# Altium schematic sheet passive_balancing.SchDoc: foxBMS BMS-Slave 12-Cell
size A3; DocumentNumber: 5; SheetNumber: 5; SheetTotal: 15; AUTHOR: Fraunhofer IISB foxBMS Team; SheetDescription: Passive Cell Balancing
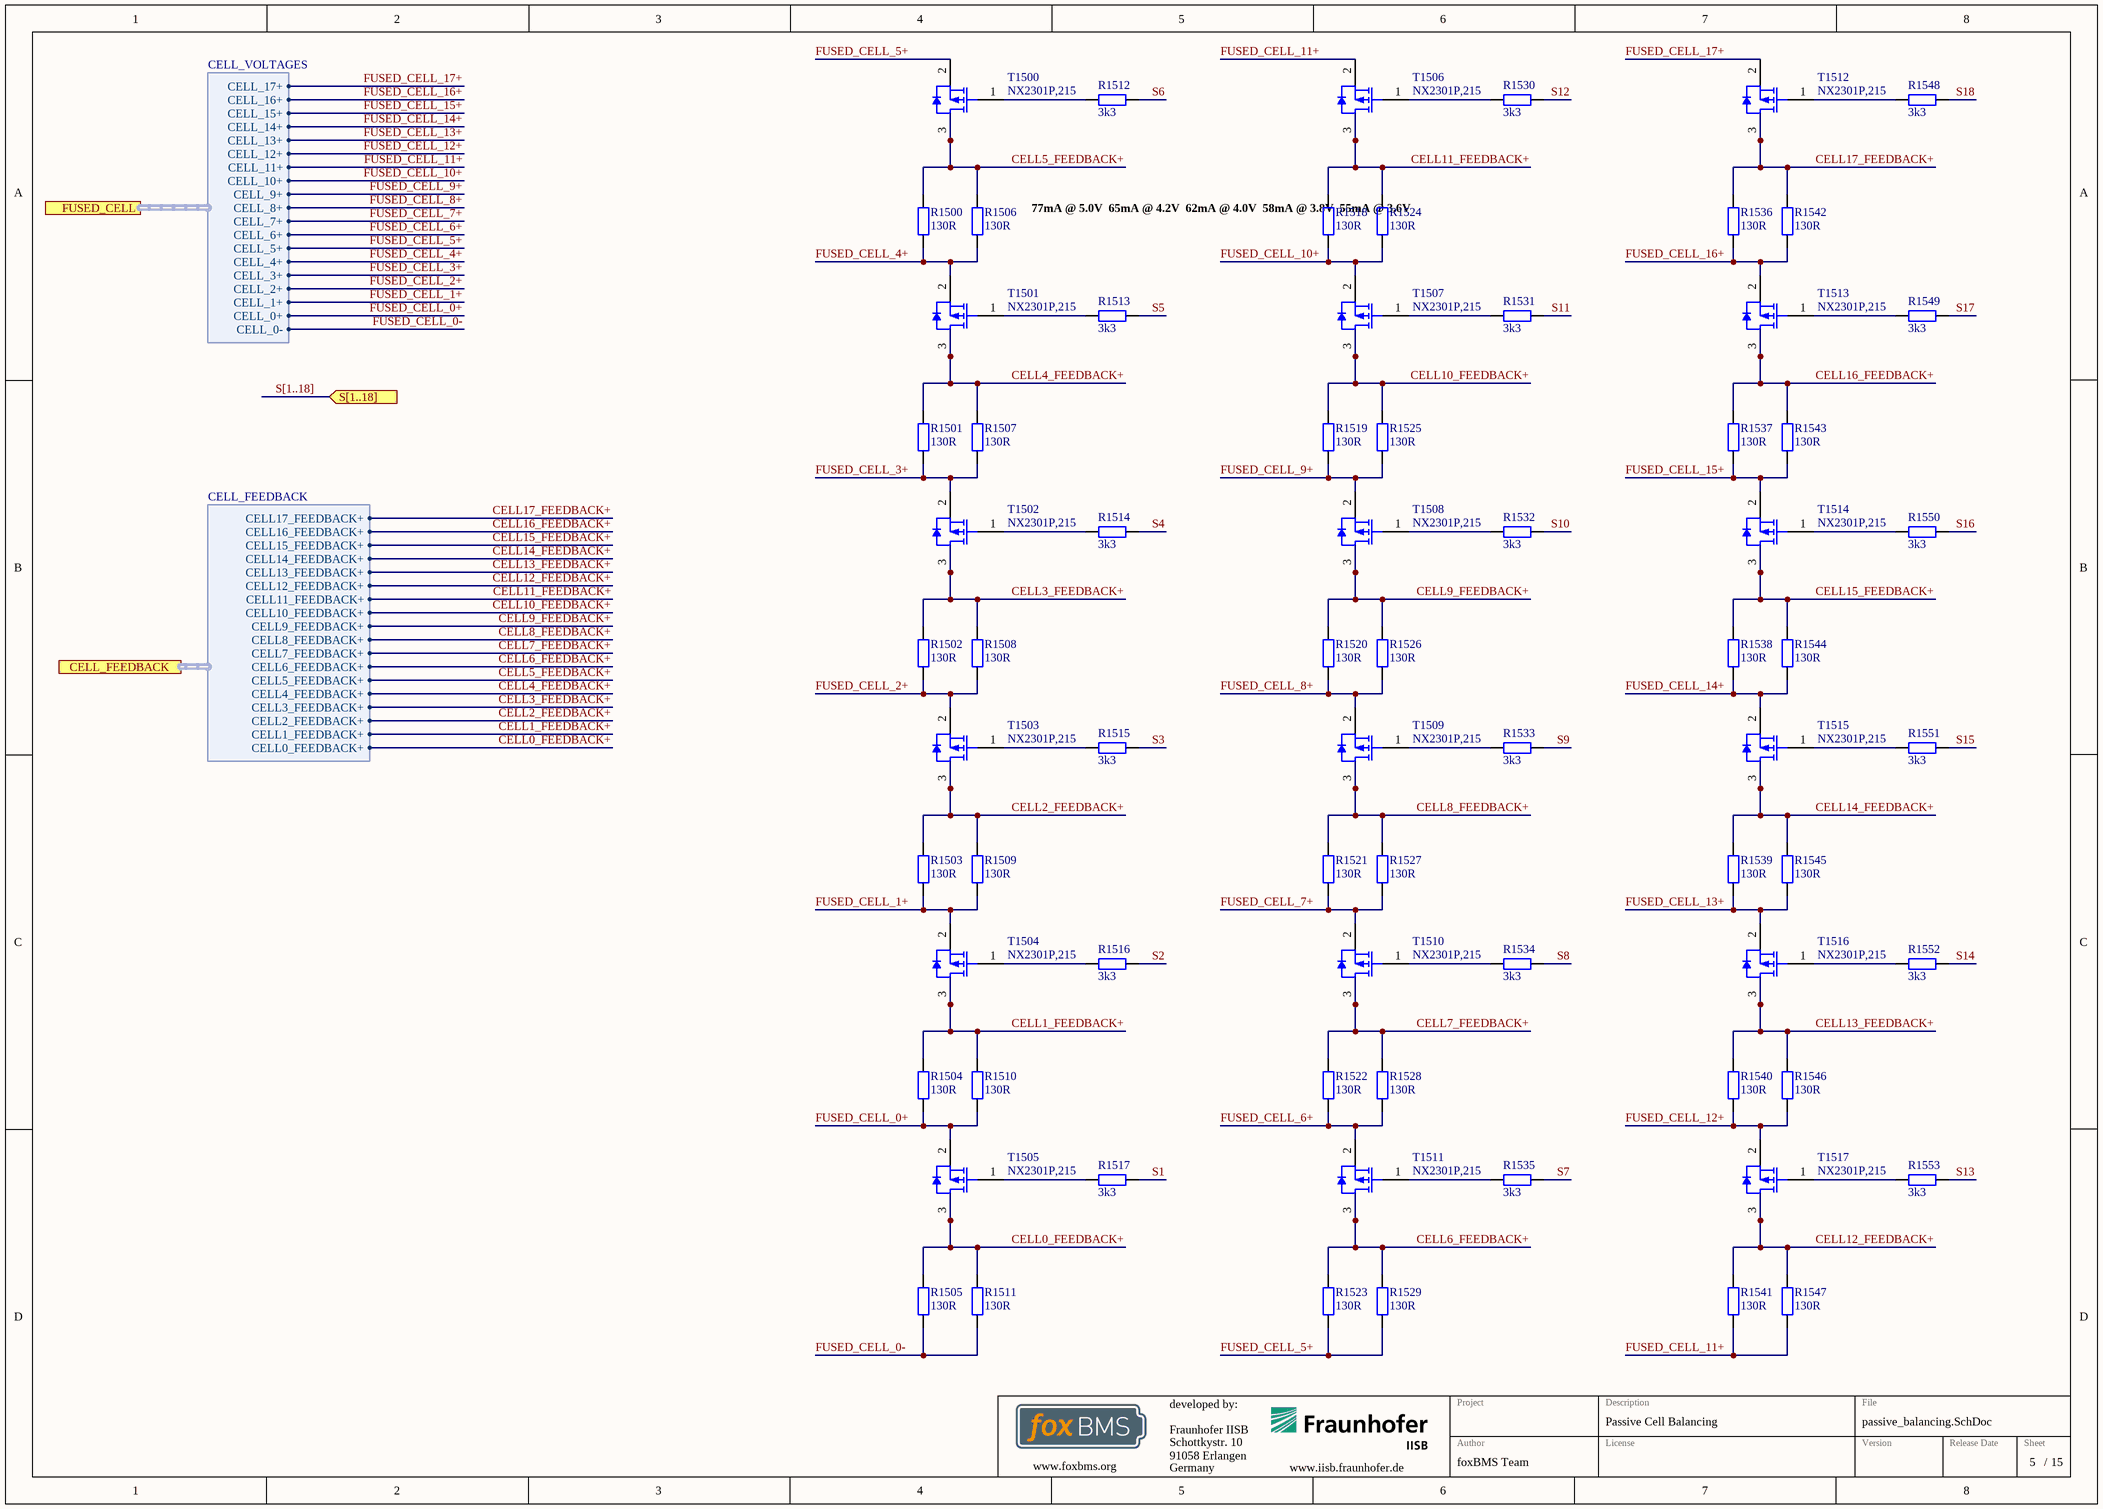
[diagram p0: passive_balancing.SchDoc]

## Parts
R1500  130R  [RESC5025X07N]
R1501  130R  [RESC5025X07N]
R1502  130R  [RESC5025X07N]
R1503  130R  [RESC5025X07N]
R1504  130R  [RESC5025X07N]
R1505  130R  [RESC5025X07N]
R1506  130R  [RESC5025X07N]
R1507  130R  [RESC5025X07N]
R1508  130R  [RESC5025X07N]
R1509  130R  [RESC5025X07N]
R1510  130R  [RESC5025X07N]
R1511  130R  [RESC5025X07N]
R1512  3k3  [RESC1608X05N]
R1513  3k3  [RESC1608X05N]
R1514  3k3  [RESC1608X05N]
R1515  3k3  [RESC1608X05N]
R1516  3k3  [RESC1608X05N]
R1517  3k3  [RESC1608X05N]
R1518  130R  [RESC5025X07N]
R1519  130R  [RESC5025X07N]
R1520  130R  [RESC5025X07N]
R1521  130R  [RESC5025X07N]
R1522  130R  [RESC5025X07N]
R1523  130R  [RESC5025X07N]
R1524  130R  [RESC5025X07N]
R1525  130R  [RESC5025X07N]
R1526  130R  [RESC5025X07N]
R1527  130R  [RESC5025X07N]
R1528  130R  [RESC5025X07N]
R1529  130R  [RESC5025X07N]
R1530  3k3  [RESC1608X05N]
R1531  3k3  [RESC1608X05N]
R1532  3k3  [RESC1608X05N]
R1533  3k3  [RESC1608X05N]
R1534  3k3  [RESC1608X05N]
R1535  3k3  [RESC1608X05N]
R1536  130R  [RESC5025X07N]
R1537  130R  [RESC5025X07N]
R1538  130R  [RESC5025X07N]
R1539  130R  [RESC5025X07N]
R1540  130R  [RESC5025X07N]
R1541  130R  [RESC5025X07N]
R1542  130R  [RESC5025X07N]
R1543  130R  [RESC5025X07N]
R1544  130R  [RESC5025X07N]
R1545  130R  [RESC5025X07N]
R1546  130R  [RESC5025X07N]
R1547  130R  [RESC5025X07N]
R1548  3k3  [RESC1608X05N]
R1549  3k3  [RESC1608X05N]
R1550  3k3  [RESC1608X05N]
R1551  3k3  [RESC1608X05N]
R1552  3k3  [RESC1608X05N]
R1553  3k3  [RESC1608X05N]
T1500  NX2301P,215  [NXP-SOT23_N]
T1501  NX2301P,215  [NXP-SOT23_N]
T1502  NX2301P,215  [NXP-SOT23_N]
T1503  NX2301P,215  [NXP-SOT23_N]
T1504  NX2301P,215  [NXP-SOT23_N]
T1505  NX2301P,215  [NXP-SOT23_N]
T1506  NX2301P,215  [NXP-SOT23_N]
T1507  NX2301P,215  [NXP-SOT23_N]
T1508  NX2301P,215  [NXP-SOT23_N]
T1509  NX2301P,215  [NXP-SOT23_N]
T1510  NX2301P,215  [NXP-SOT23_N]
T1511  NX2301P,215  [NXP-SOT23_N]
T1512  NX2301P,215  [NXP-SOT23_N]
T1513  NX2301P,215  [NXP-SOT23_N]
T1514  NX2301P,215  [NXP-SOT23_N]
T1515  NX2301P,215  [NXP-SOT23_N]
T1516  NX2301P,215  [NXP-SOT23_N]
T1517  NX2301P,215  [NXP-SOT23_N]

## Ports
CELL_FEEDBACK (harness CELL_FEEDBACK), FUSED_CELL (harness CELL_VOLTAGES), S[1..18] (in)

## Harnesses
CELL_FEEDBACK: CELL11_FEEDBACK+, CELL10_FEEDBACK+, CELL9_FEEDBACK+, CELL8_FEEDBACK+, CELL7_FEEDBACK+, CELL6_FEEDBACK+, CELL5_FEEDBACK+, CELL4_FEEDBACK+, CELL3_FEEDBACK+, CELL2_FEEDBACK+, CELL1_FEEDBACK+, CELL0_FEEDBACK+, CELL12_FEEDBACK+, CELL13_FEEDBACK+, CELL14_FEEDBACK+, CELL15_FEEDBACK+, CELL16_FEEDBACK+, CELL17_FEEDBACK+
CELL_VOLTAGES: CELL_0-, CELL_0+, CELL_1+, CELL_10+, CELL_11+, CELL_12+, CELL_13+, CELL_14+, CELL_15+, CELL_16+, CELL_17+, CELL_2+, CELL_3+, CELL_4+, CELL_5+, CELL_6+, CELL_7+, CELL_8+, CELL_9+

## Nets
CELL0_FEEDBACK+: R1505.2 R1511.2 T1505.3(D) ; port CELL_FEEDBACK.CELL0_FEEDBACK+
CELL1_FEEDBACK+: R1504.2 R1510.2 T1504.3(D) ; port CELL_FEEDBACK.CELL1_FEEDBACK+
CELL2_FEEDBACK+: R1503.2 R1509.2 T1503.3(D) ; port CELL_FEEDBACK.CELL2_FEEDBACK+
CELL3_FEEDBACK+: R1502.2 R1508.2 T1502.3(D) ; port CELL_FEEDBACK.CELL3_FEEDBACK+
CELL4_FEEDBACK+: R1501.2 R1507.2 T1501.3(D) ; port CELL_FEEDBACK.CELL4_FEEDBACK+
CELL5_FEEDBACK+: R1500.2 R1506.2 T1500.3(D) ; port CELL_FEEDBACK.CELL5_FEEDBACK+
CELL6_FEEDBACK+: R1523.2 R1529.2 T1511.3(D) ; port CELL_FEEDBACK.CELL6_FEEDBACK+
CELL7_FEEDBACK+: R1522.2 R1528.2 T1510.3(D) ; port CELL_FEEDBACK.CELL7_FEEDBACK+
CELL8_FEEDBACK+: R1521.2 R1527.2 T1509.3(D) ; port CELL_FEEDBACK.CELL8_FEEDBACK+
CELL9_FEEDBACK+: R1520.2 R1526.2 T1508.3(D) ; port CELL_FEEDBACK.CELL9_FEEDBACK+
CELL10_FEEDBACK+: R1519.2 R1525.2 T1507.3(D) ; port CELL_FEEDBACK.CELL10_FEEDBACK+
CELL11_FEEDBACK+: R1518.2 R1524.2 T1506.3(D) ; port CELL_FEEDBACK.CELL11_FEEDBACK+
CELL12_FEEDBACK+: R1541.2 R1547.2 T1517.3(D) ; port CELL_FEEDBACK.CELL12_FEEDBACK+
CELL13_FEEDBACK+: R1540.2 R1546.2 T1516.3(D) ; port CELL_FEEDBACK.CELL13_FEEDBACK+
CELL14_FEEDBACK+: R1539.2 R1545.2 T1515.3(D) ; port CELL_FEEDBACK.CELL14_FEEDBACK+
CELL15_FEEDBACK+: R1538.2 R1544.2 T1514.3(D) ; port CELL_FEEDBACK.CELL15_FEEDBACK+
CELL16_FEEDBACK+: R1537.2 R1543.2 T1513.3(D) ; port CELL_FEEDBACK.CELL16_FEEDBACK+
CELL17_FEEDBACK+: R1536.2 R1542.2 T1512.3(D) ; port CELL_FEEDBACK.CELL17_FEEDBACK+
FUSED_CELL_0+: R1504.1 R1510.1 T1505.2(S) ; port FUSED_CELL.CELL_0+
FUSED_CELL_0-: R1505.1 R1511.1 ; port FUSED_CELL.CELL_0-
FUSED_CELL_1+: R1503.1 R1509.1 T1504.2(S) ; port FUSED_CELL.CELL_1+
FUSED_CELL_2+: R1502.1 R1508.1 T1503.2(S) ; port FUSED_CELL.CELL_2+
FUSED_CELL_3+: R1501.1 R1507.1 T1502.2(S) ; port FUSED_CELL.CELL_3+
FUSED_CELL_4+: R1500.1 R1506.1 T1501.2(S) ; port FUSED_CELL.CELL_4+
FUSED_CELL_5+: R1523.1 R1529.1 T1500.2(S) ; port FUSED_CELL.CELL_5+
FUSED_CELL_6+: R1522.1 R1528.1 T1511.2(S) ; port FUSED_CELL.CELL_6+
FUSED_CELL_7+: R1521.1 R1527.1 T1510.2(S) ; port FUSED_CELL.CELL_7+
FUSED_CELL_8+: R1520.1 R1526.1 T1509.2(S) ; port FUSED_CELL.CELL_8+
FUSED_CELL_9+: R1519.1 R1525.1 T1508.2(S) ; port FUSED_CELL.CELL_9+
FUSED_CELL_10+: R1518.1 R1524.1 T1507.2(S) ; port FUSED_CELL.CELL_10+
FUSED_CELL_11+: R1541.1 R1547.1 T1506.2(S) ; port FUSED_CELL.CELL_11+
FUSED_CELL_12+: R1540.1 R1546.1 T1517.2(S) ; port FUSED_CELL.CELL_12+
FUSED_CELL_13+: R1539.1 R1545.1 T1516.2(S) ; port FUSED_CELL.CELL_13+
FUSED_CELL_14+: R1538.1 R1544.1 T1515.2(S) ; port FUSED_CELL.CELL_14+
FUSED_CELL_15+: R1537.1 R1543.1 T1514.2(S) ; port FUSED_CELL.CELL_15+
FUSED_CELL_16+: R1536.1 R1542.1 T1513.2(S) ; port FUSED_CELL.CELL_16+
FUSED_CELL_17+: T1512.2(S) ; port FUSED_CELL.CELL_17+
S1: R1517.2
S2: R1516.2
S3: R1515.2
S4: R1514.2
S5: R1513.2
S6: R1512.2
S7: R1535.2
S8: R1534.2
S9: R1533.2
S10: R1532.2
S11: R1531.2
S12: R1530.2
S13: R1553.2
S14: R1552.2
S15: R1551.2
S16: R1550.2
S17: R1549.2
S18: R1548.2
NetR1512_1: R1512.1 T1500.1(G)
NetR1513_1: R1513.1 T1501.1(G)
NetR1514_1: R1514.1 T1502.1(G)
NetR1515_1: R1515.1 T1503.1(G)
NetR1516_1: R1516.1 T1504.1(G)
NetR1517_1: R1517.1 T1505.1(G)
NetR1530_1: R1530.1 T1506.1(G)
NetR1531_1: R1531.1 T1507.1(G)
NetR1532_1: R1532.1 T1508.1(G)
NetR1533_1: R1533.1 T1509.1(G)
NetR1534_1: R1534.1 T1510.1(G)
NetR1535_1: R1535.1 T1511.1(G)
NetR1548_1: R1548.1 T1512.1(G)
NetR1549_1: R1549.1 T1513.1(G)
NetR1550_1: R1550.1 T1514.1(G)
NetR1551_1: R1551.1 T1515.1(G)
NetR1552_1: R1552.1 T1516.1(G)
NetR1553_1: R1553.1 T1517.1(G)

## Buses and harness runs
bus S[1..18] = port S[1..18]

## Notes on the sheet
- 77mA @ 5.0V
  65mA @ 4.2V
  62mA @ 4.0V
  58mA @ 3.8V
  55mA @ 3.6V
- Fraunhofer IISB
- Schottkystr. 10
- developed by:
- 91058 Erlangen
- Germany
- Author
- Project
- License
- Description
- File
- Version
- Release Date
- Sheet
- www.foxbms.org
- www.iisb.fraunhofer.de
- foxBMS Team
- /

## Library data of the parts
R1500-R1511 R1518-R1529 R1536-R1547 = gen_R_130R_2010: SMD Resistor 130R 2010; Tolerance: 5%; Power: 0.75W; Case EIA: 2010; Case Metric: 5025; Maximum Working Voltage: 400V; PnP Package: R_2010; Automotive Qualified: True; Part Number: gen_R_130R_2010; Operating Temperature: -55°C - +155°C; Resistance: 130R; Series: E24, E96; PnP Value: 130R; Supplier 1: Farnell; Supplier Part Number 1: 1892735
R1512-R1517 R1530-R1535 R1548-R1553 = gen_R_3k3_0603: SMD Resistor 3k3 0603; Tolerance: 1%; Power: 0.1W; Case EIA: 0603; Case Metric: 1608; Maximum Working Voltage: 75V; PnP Package: R_0603; Automotive Qualified: True; Part Number: gen_R_3k3_0603; Operating Temperature: -55°C - +155°C; Resistance: 3k3; Series: E24; PnP Value: 3k3; Supplier 1: Farnell; Supplier Part Number 1: 2303173
T1500-T1517 = CMP-1259-00090-1: P-Channel Trench MOSFET, -20 V, -2 A, -55 to 150 degC, 3-Pin SOT23, Tape and Reel; Manufacturer: NXP Semiconductors; VGSth [typ] (V): -0.75; Channel Type: P; Packing: Tape & Reel; Automotive Qualified: Y; IDM [max] (A): -6; PackageReference: SOT23; PartNumber: NX2301P,215; PackageVersion: 06-03-16, 03/2006; ComponentLink1URL: http://www.nxp.com/; ID [max] (A): -2; Mounting Technology: Surface Mount; ComponentLink1Description: Manufacturer URL; VDS [max] (V): -20; Code_JEDEC: TO-236AB; DatasheetVersion: Rev. 1; ComponentLink3URL: http://www.nxp.com/documents/outline_drawing/sot023_po.pdf; ComponentLink2Description: Datasheet; PackageDescription: 3-Pin Small Outline Transistor Package, Body 2.9 x 1.3 mm, Pitch 0.95 mm; ComponentLink3Description: Package Specification; ComponentLink2URL: http://www.nxp.com/documents/data_sheet/NX2301P.pdf